# Altium schematic sheet 01-PLAN-B.SchDoc
size A4
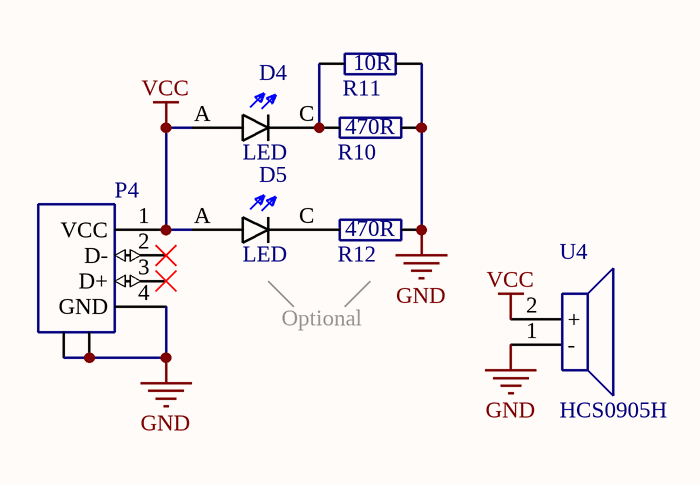
[diagram p0: 01-PLAN-B.SchDoc]

## Parts
D4  LED  [LED_0805_INVERTED]
D5  LED  [LED_0805_INVERTED]
P4  440247-2  [USB A type r/a male DIP]  (value not drawn)
R10  Resistance: 470R  [R0603_NOSILK]
R11  Resistance: 10R  [R0603_NOSILK]
R12  Resistance: 470R  [R0603_NOSILK]
U4  HCS0905H  [HCS09H_THROUGH_HOLE]

## Nets
GND: P4.4(GND) P4.SHIELD R10.2 R11.2 R12.2 U4.1(-)
VCC: D4.A D5.A P4.1(VCC) U4.2(+)
NetD4_C: D4.C R10.1 R11.1
NetD5_C: D5.C R12.1

Not connected (* = marked no-connect by the designer): P4 2(D-)* 3(D+)*

## Notes on the sheet
- Optional

## Library data of the parts
D4 D5 = LED: Led General; MF: Dialight; MP: 598-8140-107F; Owned: 3000; SnapEDA_Link: https://www.snapeda.com/parts/598-8140-107F/Dialight/view-part/?ref=snap; Price: None; Availability: Unavailable; Package: 0805 Dialight; Value: *
P4 = CON-USB-A: Mini/Micro USB B Type RCPT; Availability: Unavailable; Package: None; Price: None; Value: *; PriceKosmodromUAH: 0; Kosmodrom: http://www.kosmodrom.com.ua/; MF: *
R10 R12 = R0603_470R: Resistor General; Tolerance: 5%; Owned: 3000; Size: 0603
R11 = R0603_10R: Resistor General; Tolerance: 5%; Owned: 3000; Size: 0603; PriceRCSUAH: *; RCS: *
U4 = HCS0905H: 5V Buzzer GEN